# EAGLE design RPiPwrCtrlBrd (EAGLE 7.4.0)
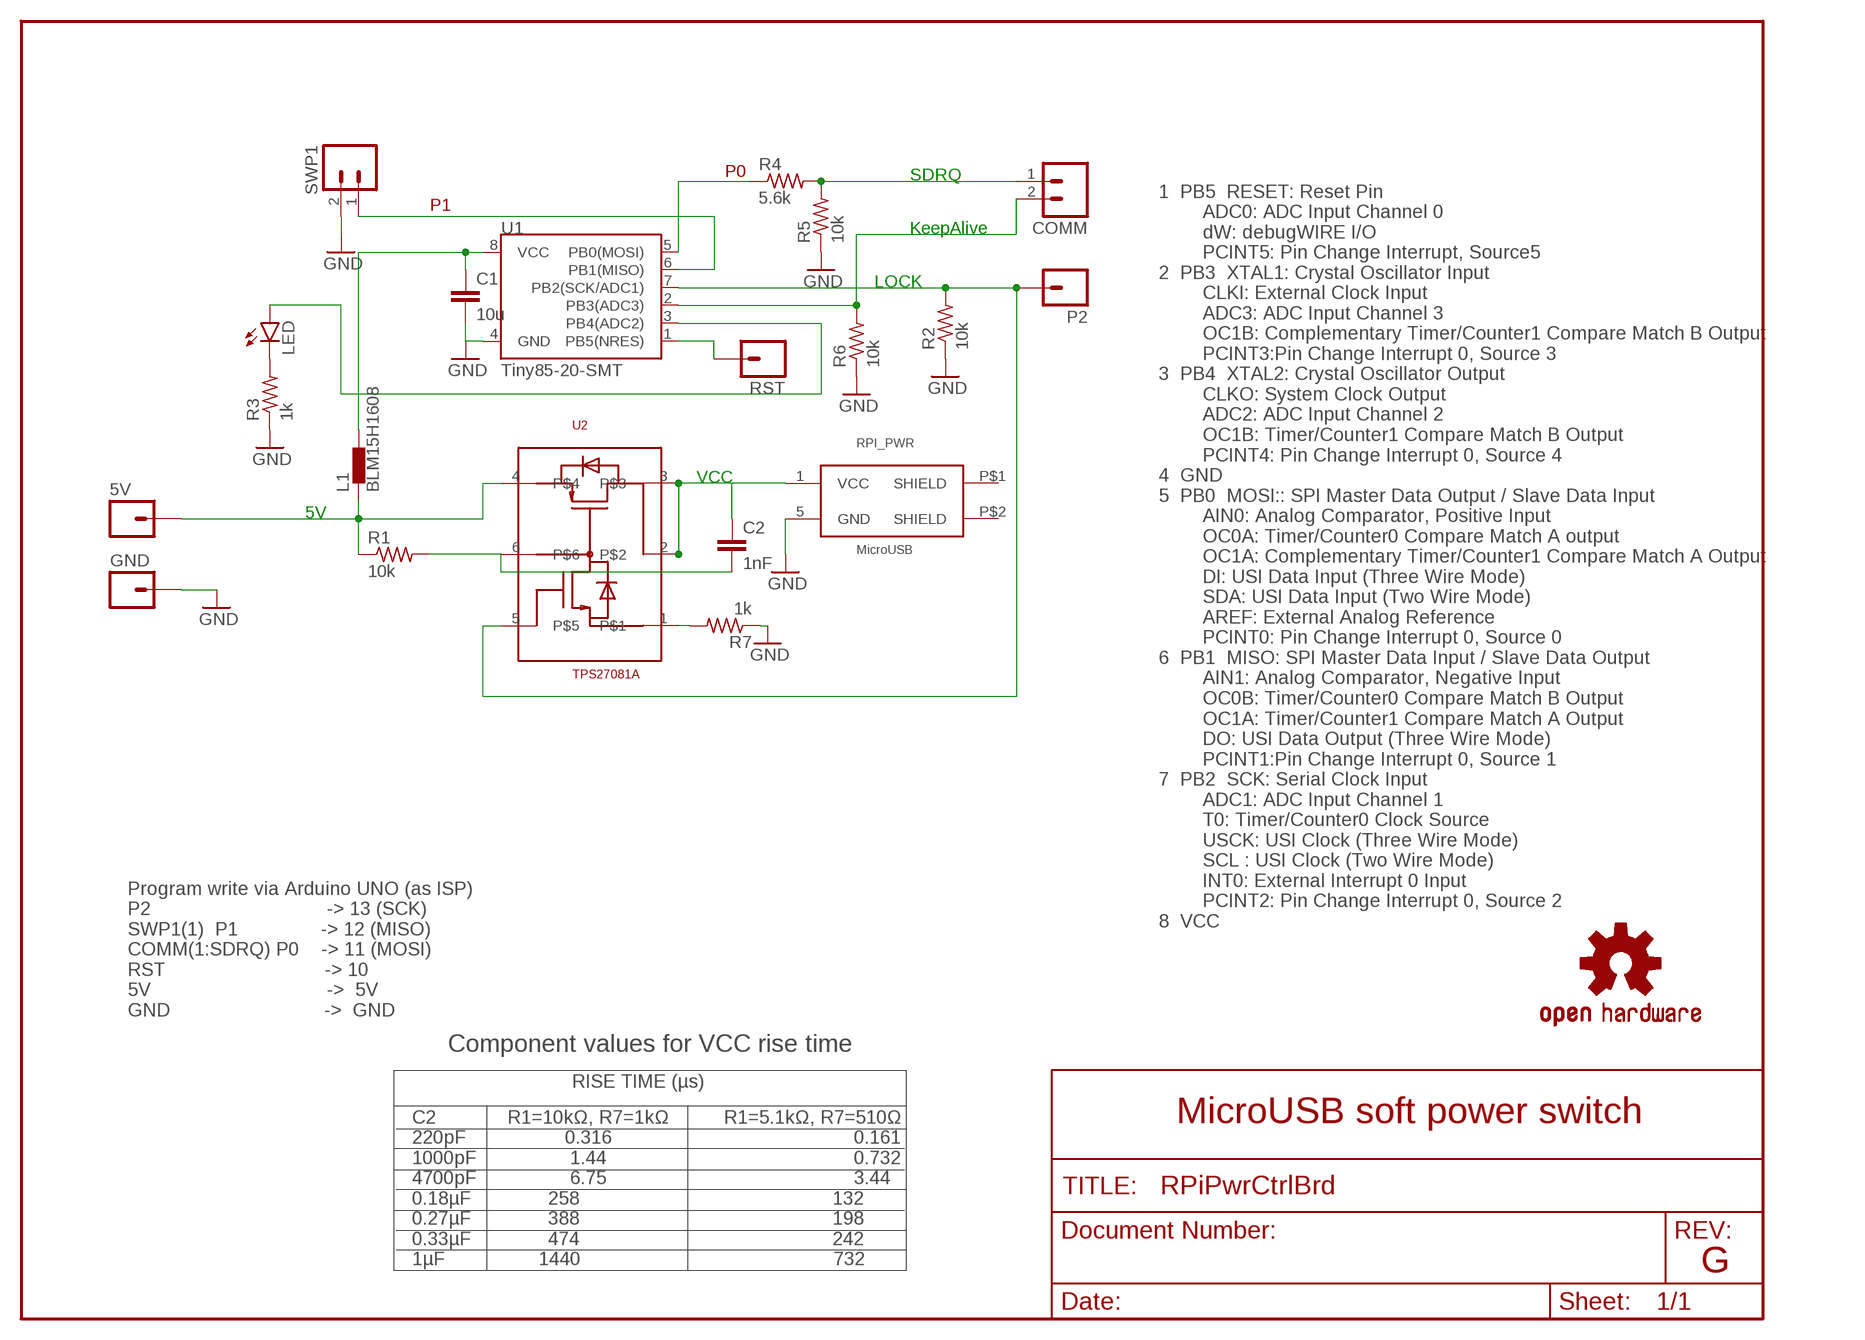
[diagram p0: schematic, sheet 1]

## Parts
5V  M01PTH  [1X01]
C1  10u  CAP1608  [1608]
C2  1nF  CAP1608  [1608]
COMM  M02PTH  [1X02]
GND  M01PTH  [1X01]
L1  BLM15H1608  [1608]
LED  LED0603  [LED-0603]
P2  M01PTH  [1X01]
R1  10k  R-US_1608  [1608]
R2  10k  R-US_1608  [1608]
R3  1k  R-US_1608  [1608]
R4  5.6k  R-US_1608  [1608]
R5  10k  R-US_1608  [1608]
R6  10k  R-US_1608  [1608]
R7  1k  R-US_1608  [1608]
RPI_PWR  MicroUSB  USB_MICROB_PLUG_PWR  [MICRO-B-THPWR]
RST  M01PTH  [1X01]
SWP1  M02PTH  [1X02]
U1  Tiny85-20-SMT  ATTINY45TINY85-20-SMT  [SO08-EIAJ]
U2  TPS27081A  [SOT23-6]
U$1  OSHW-LOGOS  [OSHW-LOGO-S]

## Nets
5V: 5V.1 L1.P$1 R1.P$1 U2.4
GND: C1.P$2 GND.1 R2.P$1 R3.P$1 R5.P$1 R6.P$1 R7.P$1 RPI_PWR.5(GND) SWP1.2 U1.4(GND)
IN: COMM.2 R6.P$2 U1.2(PB3(ADC3))
N$1: C2.P$2 R1.P$2 U2.6
N$3: LED.C R3.P$2
N$5: LED.A U1.3(PB4(ADC2))
N$7: C1.P$1 L1.P$2 U1.8(VCC)
N$8: R7.P$2 U2.1
N$9: RST.1 U1.1(PB5(NRES))
OUT: COMM.1 R4.P$2 R5.P$2
P0: R4.P$1 U1.5(PB0(MOSI))
P1: SWP1.1 U1.6(PB1(MISO))
P2: P2.1 R2.P$2 U1.7(PB2(SCK/ADC1)) U2.5
VCC: C2.P$1 RPI_PWR.1(VCC) U2.2 U2.3
Unconnected: RPI_PWR.P$1(SHIELD) RPI_PWR.P$2(SHIELD)

## Notes on the sheet
- P0 | SDRQ
- P1
- KeepAlive
- LOCK
- VCC
- 5V
- 1  PB5  RESET: Reset Pin
          ADC0: ADC Input Channel 0
          dW: debugWIRE I/O
          PCINT5: Pin Change Interrupt, Source5
  2  PB3  XTAL1: Crystal Oscillator Input
          CLKI: External Clock Input
          ADC3: ADC Input Channel 3
          OC1B: Complementary Timer/Counter1 Compare Match B Output
          PCINT3:Pin Change Interrupt 0, Source 3
  3  PB4  XTAL2: Crystal Oscillator Output
          CLKO: System Clock Output
          ADC2: ADC Input Channel 2
          OC1B: Timer/Counter1 Compare Match B Output
          PCINT4: Pin Change Interrupt 0, Source 4
  4  GND
  5  PB0  MOSI:: SPI Master Data Output / Slave Data Input
          AIN0: Analog Comparator, Positive Input
          OC0A: Timer/Counter0 Compare Match A output
          OC1A: Complementary Timer/Counter1 Compare Match A Output
          DI: USI Data Input (Three Wire Mode)
          SDA: USI Data Input (Two Wire Mode)
          AREF: External Analog Reference
          PCINT0: Pin Change Interrupt 0, Source 0
  6  PB1  MISO: SPI Master Data Input / Slave Data Output
          AIN1: Analog Comparator, Negative Input
          OC0B: Timer/Counter0 Compare Match B Output
          OC1A: Timer/Counter1 Compare Match A Output
          DO: USI Data Output (Three Wire Mode)
          PCINT1:Pin Change Interrupt 0, Source 1
  7  PB2  SCK: Serial Clock Input
          ADC1: ADC Input Channel 1
          T0: Timer/Counter0 Clock Source
          USCK: USI Clock (Three Wire Mode)
          SCL : USI Clock (Two Wire Mode)
          INT0: External Interrupt 0 Input
          PCINT2: Pin Change Interrupt 0, Source 2
  8  VCC
- Program write via Arduino UNO (as ISP)
  P2                                -> 13 (SCK)
  SWP1(1)  P1               -> 12 (MISO)
  COMM(1:SDRQ) P0    -> 11 (MOSI)
  RST                             -> 10
  5V                                ->  5V
  GND                            ->  GND
- Component values for VCC rise time
- RISE TIME (µs)
- MicroUSB soft power switch
- C2             R1=10kΩ, R7=1kΩ          R1=5.1kΩ, R7=510Ω
  220pF                  0.316                                            0.161
  1000pF                 1.44                                             0.732
  4700pF                 6.75                                             3.44
  0.18µF              258                                              132
  0.27µF              388                                              198
  0.33µF              474                                              242
  1µF                 1440                                              732
- G

## Library data of the parts
5V GND P2 RST = SparkFun-Connectors:M01: Header 1 Standard 1-pin 0.1" header. Use with straight break away headers (SKU : PRT-00116), right angle break away headers (PRT-00553), swiss pins (PRT-00743), machine pins (PRT-00117), and female headers (PRT-00115).
C1 C2 = SparkFun-Capacitors:CAP: Capacitor Standard 0603 ceramic capacitor, and 0.1" leaded capacitor.
COMM SWP1 = SparkFun-Connectors:M02: Standard 2-pin 0.1" header. Use with - straight break away headers ( PRT-00116) - right angle break away headers (PRT-00553) - swiss pins (PRT-00743) - machine pins (PRT-00117) - female headers (PRT-00115) Molex polarized connector foot print use with: PRT-08233 with associated crimp pins and housings. 2.54_SCREWTERM for use with PRT-10571. 3.5mm Screw Terminal footprints for PRT-08084 5mm Screw Terminal footprints for use with PRT-08432
L1 = inductors:BLM15H: EMIFIL (R) Chip Ferrite Bead for GHz Noise Source: http://www.murata.com/ Ferrite Bead BLM15H.pdf
LED = SparkFun-LED:LED: LEDs Standard schematic elements and footprints for 5mm, 3mm, 1206, and 0603 sized LEDs. 5mm - Spark Fun Electronics SKU : COM-00529 (and others)
R1-R7 = KinyaLibrary:R-US_: RESISTOR, American symbol
RPI_PWR = KinyaLibrary:USB_MICROB_PLUG_PWR
U1 = SparkFun-DigitalIC:ATTINY45: Atmel 8-pin 2/4/8kB flash uC; PROD_ID: IC-09092
U2 = KinyaLibrary:TPS27081A
U$1 = SparkFun:OSHW-LOGO: Open Source Hardware Logo This logo indicates the piece of hardware it is found on incorporates a OSHW license and/or adheres to the definition of open source hardware found here: http://freedomdefined.org/OSHW

## Board
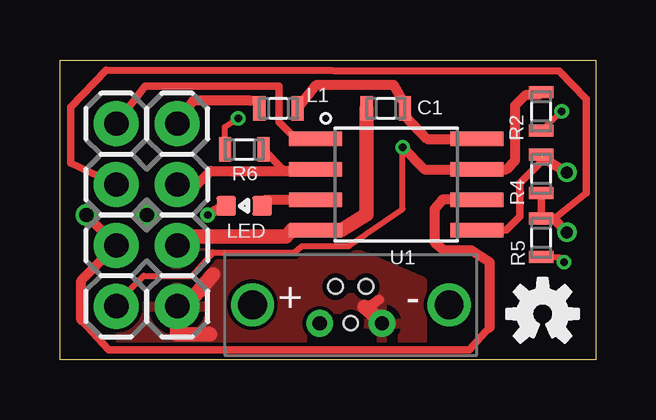
[diagram p1: board, top side]
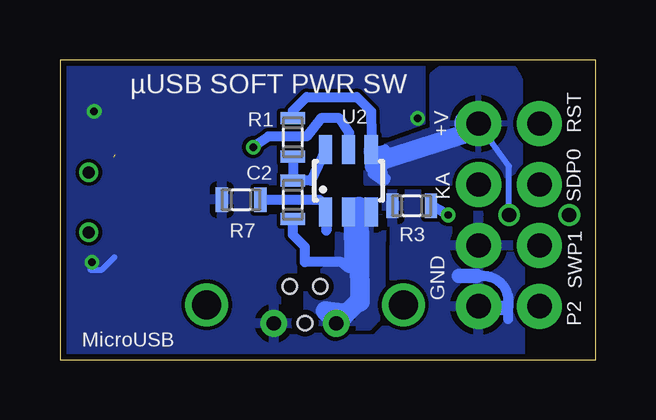
[diagram p2: board, bottom side, seen from below]

Size 22.35 x 12.5 mm. Coordinates in mm from the lower left corner, seen from the top.
Outline: 0,0 0,12.5 22.35,12.5 22.35,0 0,0
Copper layers (1*16): Top 0.035mm / dielectric 1.5mm / Bottom 0.035mm
Design rules "Elecrow_2-layer_eagle_rule": minimum track width 6mil, minimum drill 12mil, track to track 6mil, track to pad 6mil, pad to pad 6mil, via to via 6mil, smd to smd 0mil, copper to edge 10mil, drill to drill 10mil, minimum pad ring 10mil, minimum via ring 6mil, stop-mask expansion 2mil, vias tented up to drill 100mil, thermal gap 10mil

### Footprints (pad centres in the part's own frame; a part is rotated, then mirrored left to right if it is on the bottom)
1X01 = drill 1.016 pad 1.88: 1 0,0
1608 = smd 0.508 x 1.016: P$1 -0.8,0; P$2 0.8,0
1X02 = drill 1.016 pad 1.88: 1 0,0; 2 2.54,0
LED-0603 = smd 0.8 x 0.8: A 0,-0.75; C 0,0.75
MICRO-B-THPWR = drill 0.6 pad 1: 1 -1.3,-0.775; 5 1.3,-0.775 | drill 1.2: P$1 -4.1,0; P$2 4.1,0 | hole 0.6: -0.635,0.762; 0.635,0.762; 0,-0.762
SO08-EIAJ = smd 0.61 x 2.21: 1 -1.905,-3.378; 2 -0.635,-3.378; 3 0.635,-3.378; 4 1.905,-3.378; 5 1.905,3.353; 6 0.635,3.353; 7 -0.635,3.353; 8 -1.905,3.353
SOT23-6 = smd 0.55 x 1.2: 1 0.95,1.3; 2 0,1.3; 3 -0.95,1.3; 4 -0.95,-1.3; 5 0,-1.3; 6 0.95,-1.3

### Placement (x,y rotation side)
5V  4.89,9.84 0 top
C1  13.59,10.48 180 top
C2  12.64,6.67 90 bottom
COMM  2.35,7.3 0 top
GND  4.89,2.22 0 top
L1  9.11,10.48 0 top
LED  7.68,6.41 90 top
P2  2.35,2.22 180 top
R1  12.64,9.27 270 bottom
R2  20.07,10.35 90 top
R3  7.68,6.41 0 bottom
R4  20.07,7.75 270 top
R5  20.07,5.08 90 top
R6  7.68,8.76 0 top
R7  14.8,6.67 0 bottom
RPI_PWR  12.13,2.29 0 top
RST  2.35,9.84 180 top
SWP1  2.35,4.76 0 top
U1  14.03,7.3 270 top
U2  10.32,7.46 180 bottom
U$1  20.13,1.91 0 top

### Tracks (layer width: path | path; a pad name or v marks a point on that pad's centre or on a via)
5V  (via drill 0.6)
  Top 0.406: L1.P$1 8.28,10.77 7.94,10.79 5.56,10.79 5V.1
  Bottom 0.254: v3.62,6.03 3.62,8.06 5V.1
  Bottom 0.406: R1.P$1 12.64,10.38 12.06,10.95 9.97,10.95 9.37,10.36 9.37,10.23 9.34,8.64 9.34,7.97 U2.4 | 9.3,7.75 8.86,7.43 | 8.76,7.56 8.86,7.43 | 8.86,7.43 8.92,8.26 | 8.92,8.26 9.18,8.7 8.79,8.76 | 9.08,8.26 8.92,8.26
  Bottom 0.61: U2.4 9.34,8.06 9.08,8.26
  Bottom 0.813: 9.08,8.26 4.89,9.59
  Bottom 1.27: 4.89,9.59 arc-90 5.27,9.84 5V.1
  pour Bottom: 5.82,12.66 3.74,12.64 3.17,11.69 3.17,7.98 4.17,7.36 9.56,7.33 9.59,8.6 6.79,9.62 6.81,10.35 6.81,11.89
GND  (via drill 0.31)
  Top 0.254: R2.P$1 v20.92,10.35 | R5.P$1 20.8,4.28 v21.02,4.06 | R6.P$1 6.88,9.71 v7.43,10.06
  Top 0.406: 5.08,1.91 4.92,1.91 4.95,2.16 | 13.46,1.52 13.44,1.52 RPI_PWR.5 | 13.3,2.51 13.08,2.32 12.7,2.19
  Top 0.61: C1.P$2 12.79,6.06 11.75,5.4 U1.4 9.68,5.4 9.43,5.14 5.17,5.14 SWP1.2 | 4.89,1.91 4.89,1.05 6.25,1.05 6.22,1.08 | 5.08,1.91 4.89,1.91 | 4.89,1.91 5.11,2.06 | 4.95,2.16 5.11,2.06 | 5.11,2.06 6.38,3.56 | 13.46,1.52 12.7,2.19
  Bottom 0.254: v21.02,4.06 21.02,3.81 21.08,3.75 20.6,3.75 R5.P$1 | v7.43,10.06 7.27,10.06 7.3,10.03
  Bottom 0.406: 4.95,3.49 4.7,3.49 arc90 3.65,2.44 3.65,2.16 | 3.65,1.68 3.65,2.16 | 3.65,2.16 3.81,2.16
  Bottom 0.61: 5.71,3.49 4.95,3.49 | 3.81,2.16 4.86,2.16
  pour Bottom (rank 6): 3.17,-0.64 22.86,-0.64 22.86,13.34 3.17,13.34
  pour Top: 3.81,3.81 3.17,3.81 2.54,3.17 2.54,0 3.17,-0.64 14.61,-0.64 15.11,0 15.11,3.27 12.41,4.41 4.45,4.45
IN
  Top 0.305: U1.2 9.31,7.94 R6.P$2
  Top 0.406: COMM.2 5.71,7.3 6.29,7.87 10.59,7.87 U1.2
N$1
  Bottom 0.406: R1.P$2 C2.P$2 11.88,7.46 U2.6
N$3  (via drill 0.31)
  Top 0.406: LED.C 6.79,6.44 6.82,6.41 v6.16,6.03
  Bottom 0.406: v6.16,6.03 6.9,6.44 R3.P$2
N$5
  Top 0.406: LED.A 8.59,6.67 U1.3
N$7
  Top 0.406: L1.P$2 10.71,11.46 13.91,11.46 14.35,10.69 C1.P$1 14.39,10.19 15.3,9.21 U1.8
N$8
  Bottom 0.406: R7.P$2 11.53,6.67 11.24,6.38 11.24,5.37 U2.1
N$9
  Top 0.305: U1.1 9.84,9.21 9.14,9.91 9.14,11.4 3.56,11.4 RST.1
OUT  (via drill 0.5)
  Top 0.305: COMM.1 0.45,8.19 0.45,10.54 1.94,12.06 20.83,12.03 21.94,10.86 21.94,6.95 20.61,5.88 20.57,5.88 R5.P$2 R4.P$2
  Top 0.406: v21.14,5.31 20.57,5.88
P0  (via drill 0.5)  (1 unrouted)
  Top 0.305: R4.P$1 20.07,8.26 19.18,7.37 19.18,5.97 18.61,5.4 U1.5
  Top 0.406: 20.1,8.45 v21.14,7.81
P1  (via drill 0.6)
  Top 0.305: 17.91,1.33 17.08,0.41 2.03,0.41 0.89,1.65
  Top 0.406: U1.6 15.94,6.67 15.62,6.29 15.62,4.89 16,4.57 17.14,4.57 17.91,4.06 17.91,1.33 | 0.89,1.65 0.89,3.3 SWP1.1 v1.11,6.03
P2  (via drill 0.31)
  Top 0.254: P2.1 2.35,2.35 3.49,3.49 5.52,3.49 6.38,4.48 9.78,4.48 10.1,4.73 12.03,4.73 14.29,6.29 v14.29,8.86
  Top 0.406: R2.P$2 19.96,11.05 19.43,11.05 18.99,10.6 18.99,8.32 18.61,7.94 U1.7 15.21,7.94 v14.29,8.86
  Bottom 0.406: U2.5 10.29,8.7 10.29,9.46 10.7,10.06 11.46,10.06 12.06,9.3 13.65,9.3 v14.29,8.86
VCC
  Bottom 0.305: U2.2 9.87,6.38 U2.3
  Bottom 0.406: U2.2 10.29,3.81 10.6,4.06 12.13,4.06 12.13,4.7 12.64,5.21 C2.P$1
  Bottom 0.813: 9.87,6.38 9.84,2.41 9.87,2.38 9.94,2.38 10.79,1.52 | 10.79,1.52 10.86,1.46 10.86,1.33 10.41,1.94 11.27,2.03 10.79,1.52
  pour Bottom: 8.86,5.94 10.54,5.94 10.76,5.65 10.79,4.19 12.1,3.11 12.1,1.49 11.94,1.33 9.46,1.33 8.89,1.91

### Text on the board
tPlace: + | -
bPlace: µUSB SOFT PWR SW | +V | SDP0 | KA | GND | MicroUSB
Measures: RST +5V / P0/SD KA / P1/SW GND / P2 GND